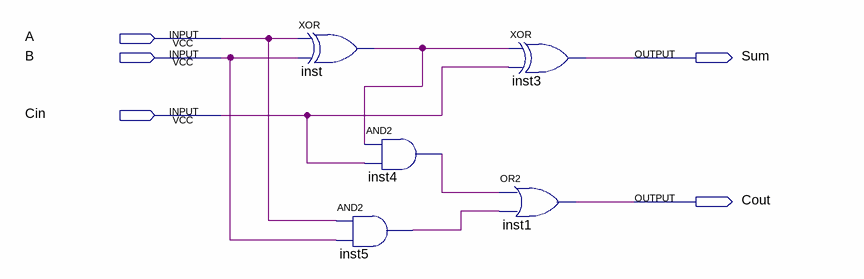
[diagram p0: schematic sheet]
// Quartus schematic Adder1Bit.bdf as structural Verilog: 5 symbols, 5 pins
module Adder1Bit (
  input  A,
  input  B,
  input  Cin,
  output Sum,
  output Cout
);

  wire inst4_out, inst5_out, inst_out;

  xor inst (inst_out, A, B);
  and inst4 (inst4_out, inst_out, Cin);
  and inst5 (inst5_out, A, B);
  xor inst3 (Sum, inst_out, Cin);
  or inst1 (Cout, inst4_out, inst5_out);
endmodule
